# EasyEDA schematic Schematic.json
TITLE: Sheet_1; REV: 1.0; Date: 2020-09-14; Sheet: 1/1; Company: Your Company
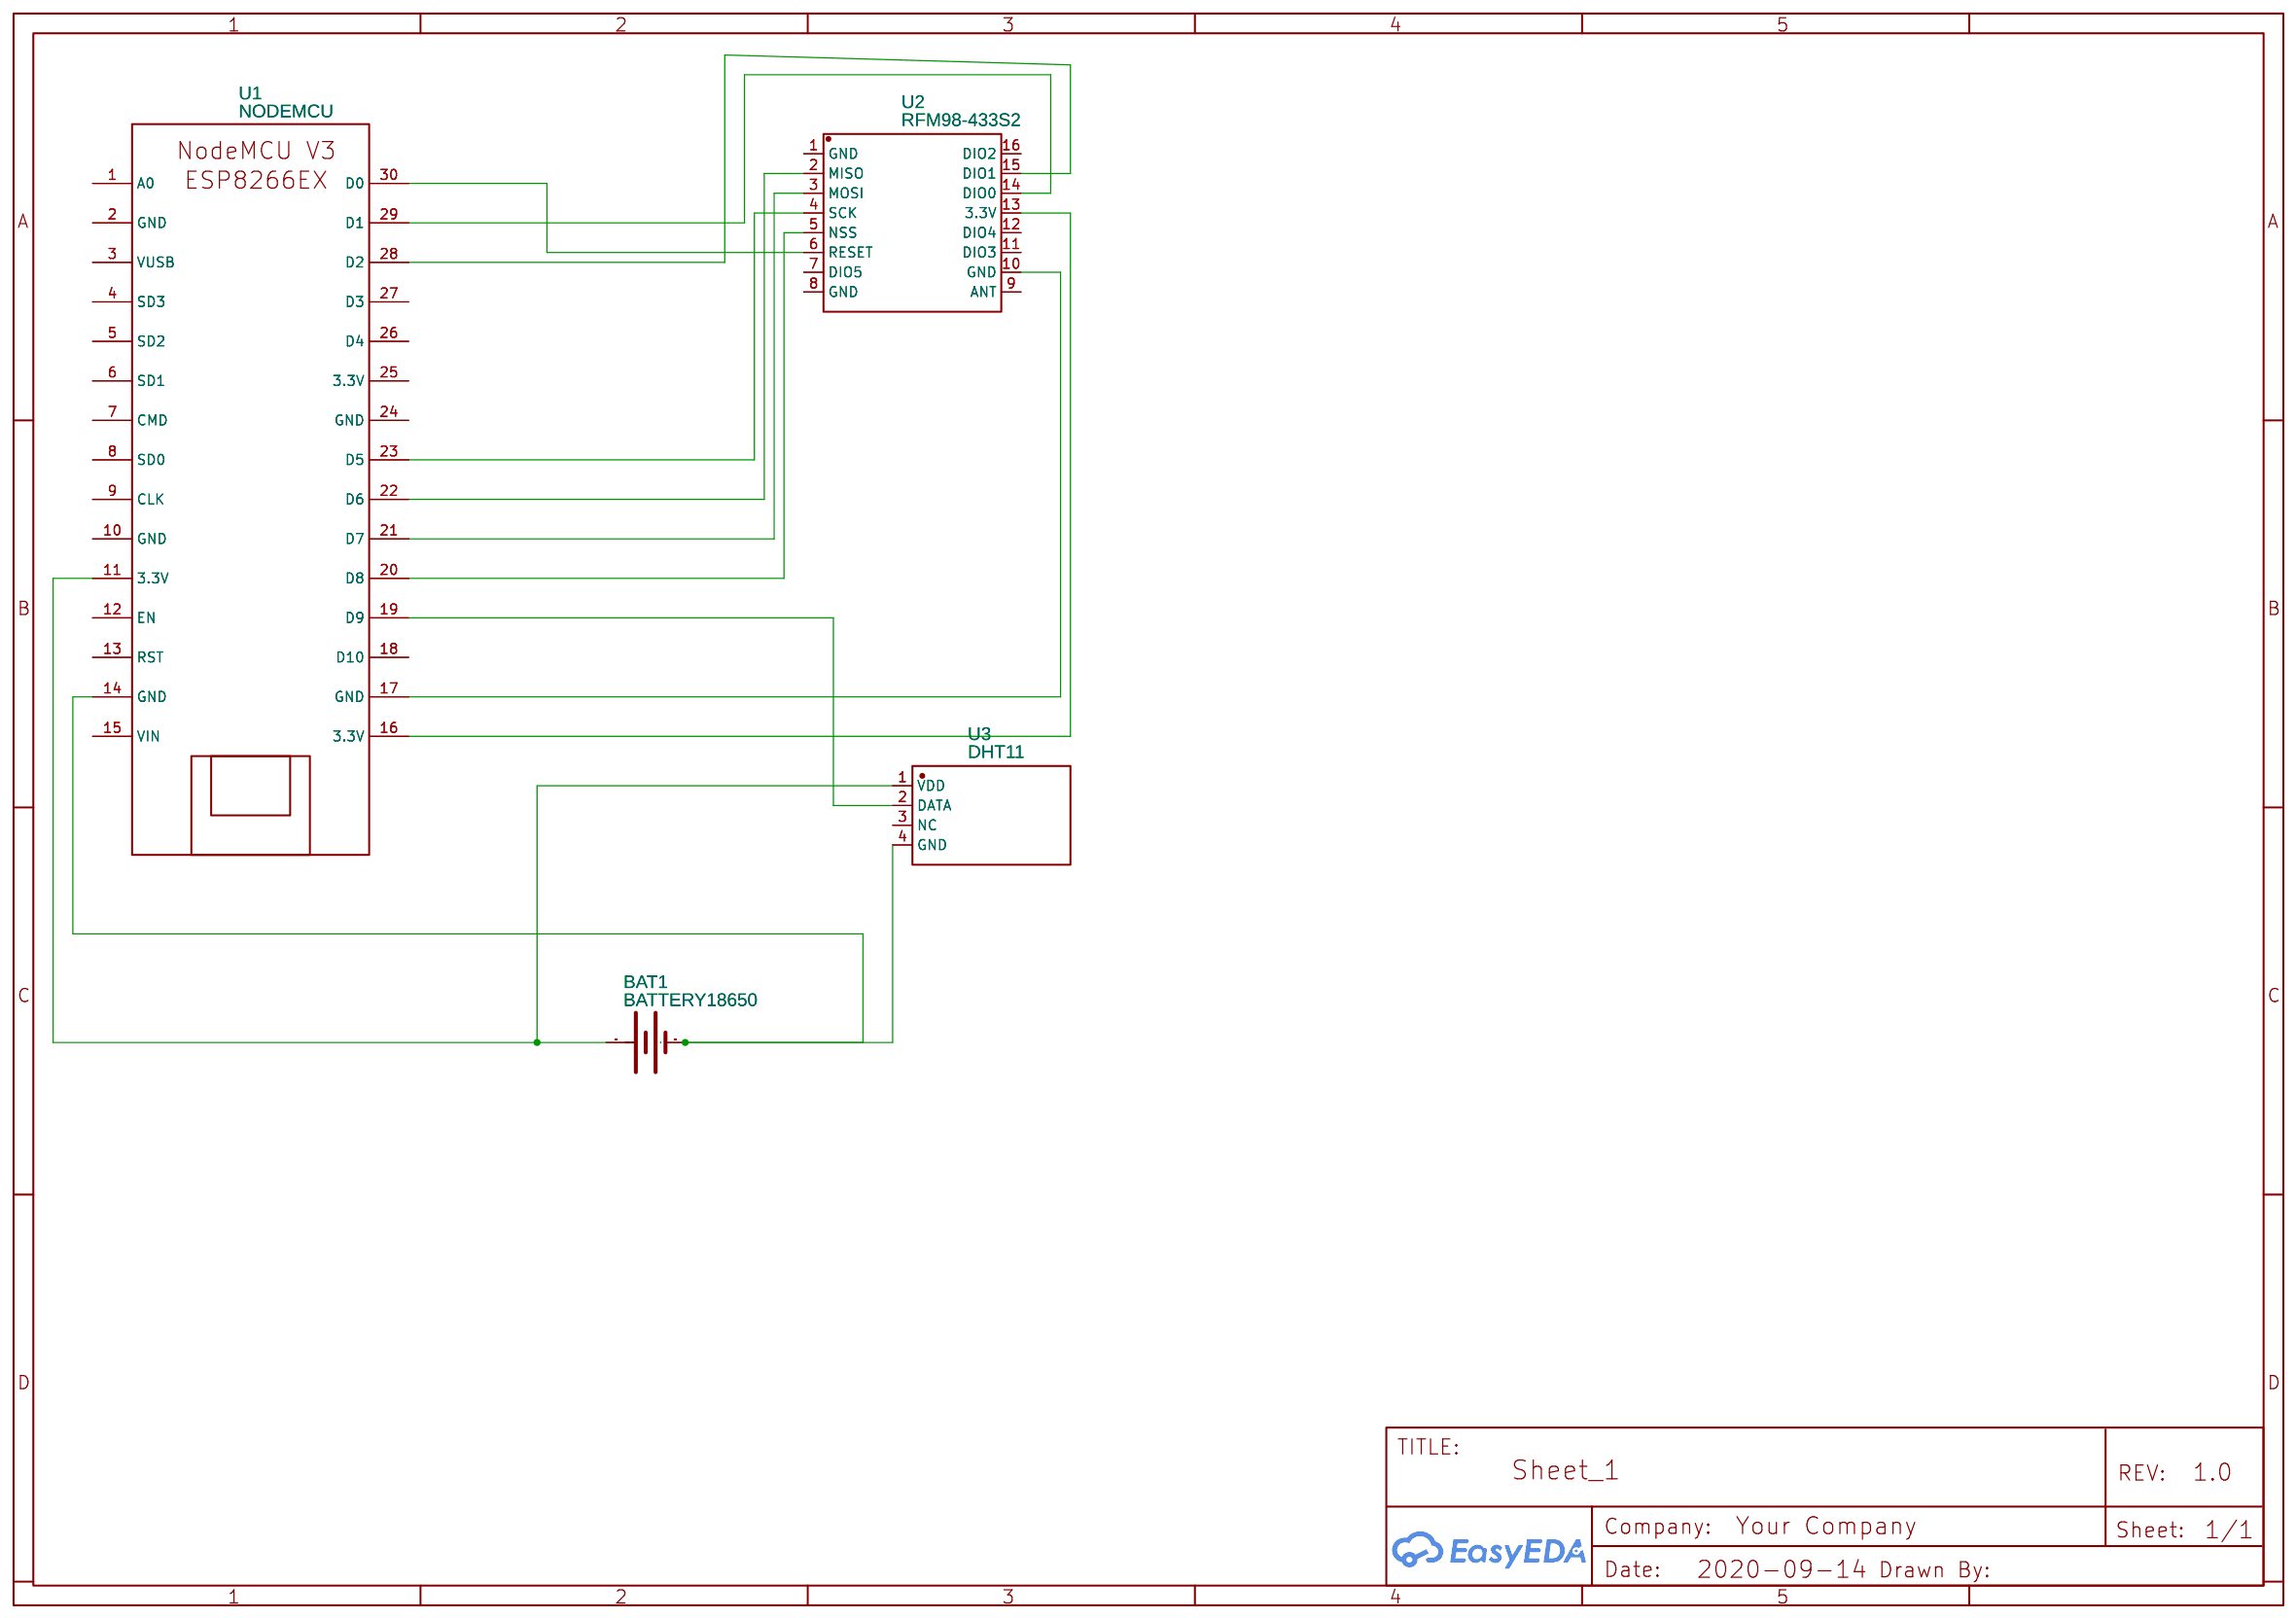
[diagram p0: schematic sheet]

## Parts
BAT1  BATTERY18650  [BATTERY_18650-HOLDER]
U1  NODEMCU  [NODEMCU_V3_ESP8266EX]
U2  RFM98-433S2  [WIRELM-SMD_RFM98-433S2]
U3  DHT11  [DHT11]

## Library data of the parts
BAT1 = BATTERY18650: Battery Holders; Contributor: SparkFun
U1 = NODEMCU: Contributor: Srinivasan J; sourceId: OGtr1ZXUS; sim: true
U2 = RFM98-433S2: Supplier: LCSC; Supplier Part: C171661; Manufacturer: HopeRF Micro-electronics; Contributor: LCSC
U3 = DHT11: Supplier: LCSC; Supplier Part: C117051; Manufacturer: Aosong (Guangzhou) Elec; Contributor: LCSC

## Nets
Net-(BAT1-GND@1): BAT1.GND@1(-) U1.14(GND) U3.4(GND)
Net-(BAT1-PWR@1): BAT1.PWR@1(+) U1.11(3.3V) U3.1(VDD)
Net-(U1-16): U1.16(3.3V) U2.13(3.3V)
Net-(U1-17): U1.17(GND) U2.10(GND)
Net-(U1-19): U1.19(D9) U3.2(DATA)
Net-(U1-20): U1.20(D8) U2.5(NSS)
Net-(U1-21): U1.21(D7) U2.3(MOSI)
Net-(U1-22): U1.22(D6) U2.2(MISO)
Net-(U1-23): U1.23(D5) U2.4(SCK)
Net-(U1-28): U1.28(D2) U2.15(DIO1)
Net-(U1-29): U1.29(D1) U2.14(DIO0)
Net-(U1-30): U1.30(D0) U2.6(RESET)

Not connected (* = marked no-connect by the designer): U1 1(A0) 2(GND) 3(VUSB) 4(SD3) 5(SD2) 6(SD1) 7(CMD) 8(SD0) 9(CLK) 10(GND) 12(EN) 13(RST) 15(VIN) 18(D10) 24(GND) 25(3.3V) 26(D4) 27(D3); U2 1(GND) 7(DIO5) 8(GND) 9(ANT) 11(DIO3) 12(DIO4) 16(DIO2); U3 3(NC)
